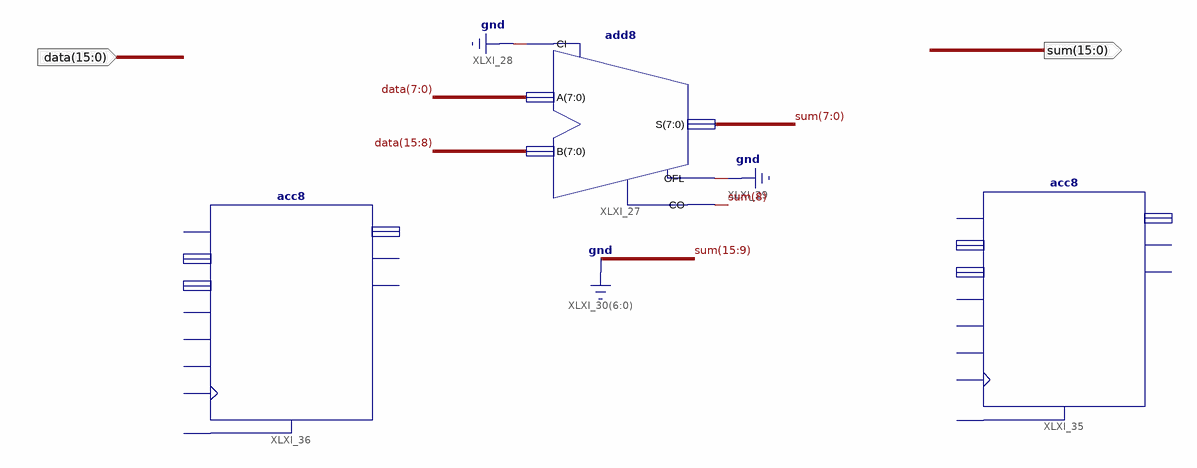
[diagram p0: schematic sheet 1]
// Xilinx ISE schematic Adder.sch (spartan6) as structural Verilog: 3 symbols, 3 ports
module Adder (
  input  [15:0] data,
  output [15:0] sum
);

  add8 XLXI_27 (.A(data[7:0]), .B(data[15:8]), .CI(1'b0), .CO(sum[8]), .OFL(1'b0), .S(sum[7:0]));
  acc8 XLXI_35 ();  // open: ADD, B, C, CE, CI, D, L, R, CO, OFL, Q
  acc8 XLXI_36 ();  // open: ADD, B, C, CE, CI, D, L, R, CO, OFL, Q

  assign sum[15:9] = {7{1'b0}};
endmodule
